# EAGLE design hoss-driver-circuit_25 (EAGLE 5.07)

## Sheet 1 of 4
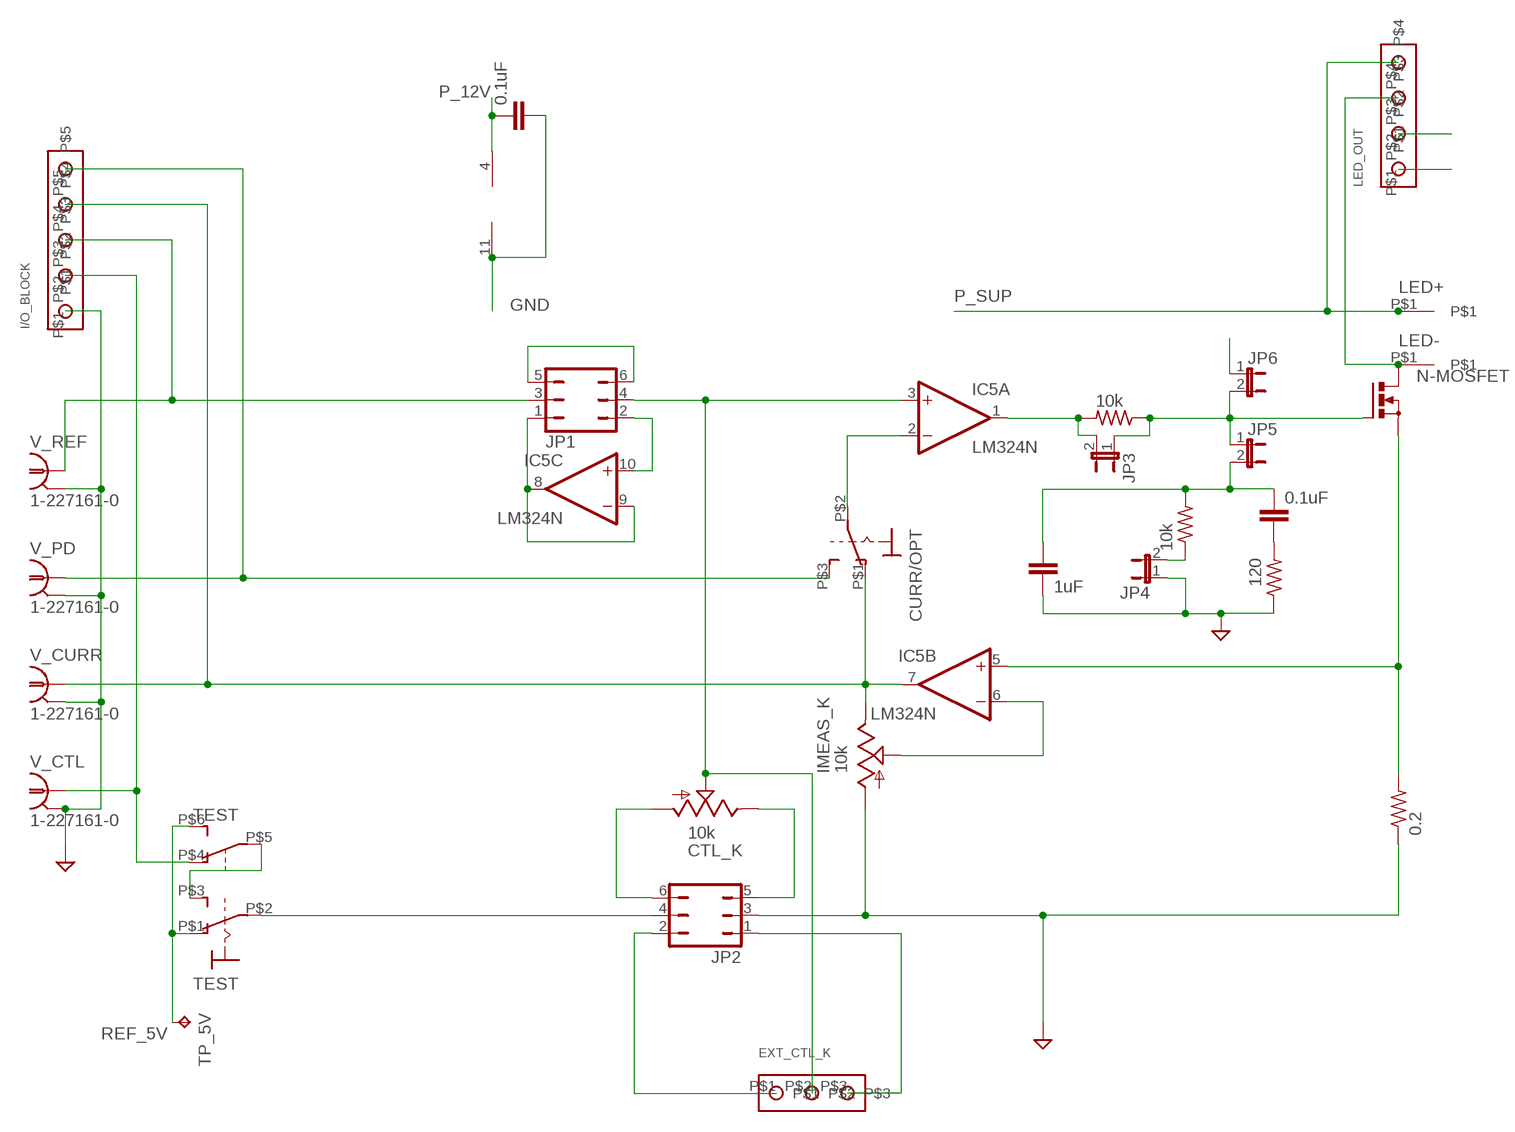
[diagram p0: schematic, sheet 1]

### Parts
C2  0.1uF  C-EU050-024X044  [C050-024X044]
C3  1uF  C-EU025-024X044  [C025-024X044]
C7  0.1uF  C-EU050-024X044  [C050-024X044]
CTL_K  10k  TRIM_US-RJ6S  [RJ6S]
CURR/OPT  SPST_SWITCH  [A_TOGGLE_SPST]
EXT_CTL_K  SCREW3  [SCREW3]
I/O_BLOCK  SCREW5  [SCREW5]
IC5  LM324N  [DIL14]
IMEAS_K  10k  TRIM_US-RJ6S  [RJ6S]
JP1  JP3Q  [JP3Q]
JP2  JP3Q  [JP3Q]
JP3  JP1E  [JP1]
JP4  JP1E  [JP1]
JP5  JP1E  [JP1]
JP6  JP1E  [JP1]
LED+  BANANA_TO_BOARD  [BANANA_TO_BOARD]
LED-  BANANA_TO_BOARD  [BANANA_TO_BOARD]
LED_OUT  SCREW4  [SCREW4]
N-MOSFET  PMOSFET_NTO220BH  [TO220BH]
R3  10k  R-US_0207/7  [0207/7]
R4  10k  R-US_0207/7  [0207/7]
R8  120  R-US_0207/7  [0207/7]
R_CURR  0.2  R-US_  [IMEAS_R]
TEST  SP3T_SWITCH  [320-938]
TP_5V  TPPAD1-13  [P1-13]
V_CTL  1-227161-0  [AMP_227161]
V_CURR  1-227161-0  [AMP_227161]
V_PD  1-227161-0  [AMP_227161]
V_REF  1-227161-0  [AMP_227161]

### Nets
GND: C3.2 C7.2 I/O_BLOCK.P$1 IC5.11(P:V-) IMEAS_K.A JP2.3 JP4.1 LED_OUT.P$1 R8.1 R_CURR.1 V_CTL.2(GND) V_CURR.2(GND) V_PD.2(GND) V_REF.2(GND) ; also sheet 2,3,4
N$1: CURR/OPT.P$2(P) IC5.2(A:-IN)
N$2: IC5.5(B:+IN) N-MOSFET.S R_CURR.2
N$3: IC5.1(A:OUT) JP3.2 R4.2
N$4: CURR/OPT.P$1(O) I/O_BLOCK.P$4 IC5.7(B:OUT) IMEAS_K.E V_CURR.1
N$5: CURR/OPT.P$3(S) I/O_BLOCK.P$5 V_PD.1
N$6: JP2.4 TEST.P$2(1:P)
N$7: CTL_K.E JP2.5
N$8: CTL_K.S EXT_CTL_K.P$2 IC5.3(A:+IN) JP1.4
N$9: IC5.8(C:OUT) IC5.9(C:-IN) JP1.1
N$10: I/O_BLOCK.P$2 TEST.P$4(B:O) V_CTL.1
N$11: C2.1 C3.1 JP5.2 R3.2
N$12: CTL_K.A JP2.6
N$13: C2.2 R8.2
N$14: IC5.10(C:+IN) JP1.2
N$15: IC5.6(B:-IN) IMEAS_K.S
N$17: JP1.5 JP1.6
N$18: I/O_BLOCK.P$3 JP1.3 V_REF.1
N$21: LED-.P$1 LED_OUT.P$3 N-MOSFET.D
N$23: TEST.P$3(1:S) TEST.P$5(B:P)
N$25: EXT_CTL_K.P$1 JP2.2
N$26: EXT_CTL_K.P$3 JP2.1
N$27: JP4.2 R3.1
N$29: JP3.1 JP5.1 JP6.2 N-MOSFET.G R4.1
N$69: JP6.1
P_12V: C7.1 IC5.4(P:V+) LED_OUT.P$2 ; also sheet 2
P_SUP: LED+.P$1 LED_OUT.P$4 ; also sheet 2,4
REF_5V: TEST.P$1(1:O) TEST.P$6(B:S) TP_5V.TP ; also sheet 2
Unconnected: IC5.12(D:+IN) IC5.13(D:-IN) IC5.14(D:OUT)

## Sheet 2 of 4
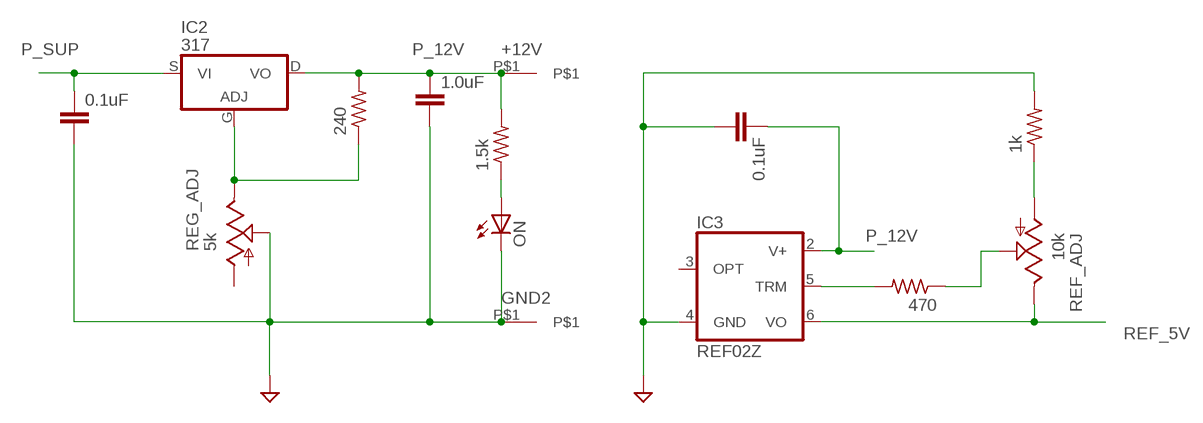
[diagram p1: schematic, sheet 2]

### Parts
+12V  BANANA_TO_BOARD  [BANANA_TO_BOARD]
C4  0.1uF  C-EU050-024X044  [C050-024X044]
C5  1.0uF  C-EU025-024X044  [C025-024X044]
C6  0.1uF  C-EU050-024X044  [C050-024X044]
GND2  BANANA_TO_BOARD  [BANANA_TO_BOARD]
IC2  317  [TO220BH]
IC3  REF02Z  [DIL08]
ON  LED3MM  [LED3MM]
R2  1.5k  R-US_0207/7  [0207/7]
R9  1k  R-US_0207/7  [0207/7]
R10  240  R-US_0207/7  [0207/7]
R12  470  R-US_0207/7  [0207/7]
REF_ADJ  10k  TRIM_US-RJ6S  [RJ6S]
REG_ADJ  5k  TRIM_US-RJ6S  [RJ6S]

### Nets
GND: C4.2 C5.2 C6.2 GND2.P$1 IC3.4(GND) ON.K(C) R9.2 REG_ADJ.S ; also sheet 1,3,4
N$19: IC2.G(ADJ) R10.1 REG_ADJ.E
N$20: IC3.5(TRM) R12.2
N$22: R12.1 REF_ADJ.S
N$24: R9.1 REF_ADJ.A
N$28: ON.A R2.1
P_12V: +12V.P$1 C5.1 C6.1 IC2.D(VO) IC3.2(V+) R2.2 R10.2 ; also sheet 1
P_SUP: C4.1 IC2.S(VI) ; also sheet 1,4
REF_5V: IC3.6(VO) REF_ADJ.E ; also sheet 1
Unconnected: IC3.3(OPT) REG_ADJ.A

## Sheet 3 of 4
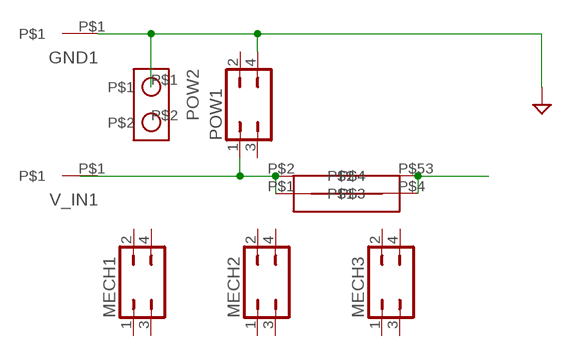
[diagram p2: schematic, sheet 3]

### Parts
GND1  BANANA_TO_BOARD  [BANANA_TO_BOARD]
MECH1  JP2Q  [JP2Q]
MECH2  JP2Q  [JP2Q]
MECH3  JP2Q  [JP2Q]
POW1  JP2Q  [JP2Q]
POW2  SCREW2  [SCREW2]
U$1  FUSE >2A  NXT-FUSE  [NXT-FUSE]
V_IN1  BANANA_TO_BOARD  [BANANA_TO_BOARD]

### Nets
GND: GND1.P$1 POW1.4 POW2.P$1 ; also sheet 1,2,4
N$61: POW1.1 U$1.P$1 U$1.P$2
P_SUP_BEFORE: U$1.P$4 U$1.P$53 ; also sheet 4
Unconnected: MECH1.1 MECH1.2 MECH1.3 MECH1.4 MECH2.1 MECH2.2 MECH2.3 MECH2.4 MECH3.1 MECH3.2 MECH3.3 MECH3.4 POW1.2 POW1.3 POW2.P$2 V_IN1.P$1

## Sheet 4 of 4
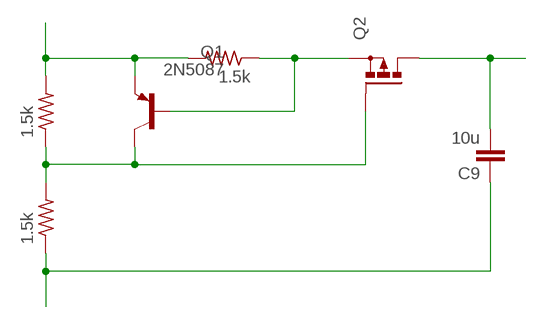
[diagram p3: schematic, sheet 4]

### Parts
C9  10u  C-EU025-024X044  [C025-024X044]
Q1  2N5087  [TO92]
Q2  PMOSFET_PTO220BH  [TO220BH]
R1  1.5k  R-US_0207/7  [0207/7]
R5  1.5k  R-US_0207/7  [0207/7]
R6  1.5k  R-US_0207/7  [0207/7]

### Nets
GND: C9.1 R5.1 ; also sheet 1,2,3
N$30: Q1.1(C) Q2.G R1.1 R5.2
N$31: Q1.2(B) Q2.S R6.1
P_SUP: C9.2 Q2.D ; also sheet 1,2
P_SUP_BEFORE: Q1.3(E) R1.2 R6.2 ; also sheet 3

## Library data of the parts
+12V GND1 GND2 LED+ LED- V_IN1 = HOSS:BANANA_TO_BOARD: Female banana socket to board, right angle. Digikey part: J111-ND (or similar).
C2-C7 C9 = rcl:C-EU: CAPACITOR, European symbol
CTL_K IMEAS_K REF_ADJ REG_ADJ = HOSS:TRIM_US-: POTENTIOMETER
CURR/OPT = HOSS:SPST_SWITCH: TOGGLE SWITCH distributor RS Components
EXT_CTL_K = HOSS:SCREW3
I/O_BLOCK = HOSS:SCREW5
IC2 = HOSS:*317: Positive VOLTAGE REGULATOR
IC3 = linear:REF02: VOLTAGE REFERENCE
IC5 = linear:LM324: OP AMP
JP1 JP2 = jumper:JP3Q: JUMPER
JP3-JP6 = jumper:JP1E: JUMPER
LED_OUT = HOSS:SCREW4
MECH1-MECH3 POW1 = jumper:JP2Q: JUMPER
N-MOSFET = transistor-power:PMOSFET_N: Power MOSFET N-Channel
ON = led:LED: LED OSRAM: - CHIPLED LG R971, LG N971, LY N971, LG Q971, LY Q971, LO R971, LY R971 LH N974, LH R974 LS Q976, LO Q976, LY Q976 LO Q996 - Hyper CHIPLED LW Q18S LB Q993, LB Q99A, LB R99A - SideLED LS A670, LO A670, LY A670, LG A670, LP A670 LB A673, LV A673, LT A673, LW A673 LH A674 LY A675 LS A676, LA A676, LO A676, LY A676, LW A676 LS A679, LY A679, LG A679 - Hyper Micro SIDELED® LS Y876, LA Y876, LO Y876, LY Y876 LT Y87S - SmartLED LW L88C, LW L88S LB L89C, LB L89S, LG L890 LS L89K, LO L89K, LY L89K LS L896, LA L896, LO L896, LY L896 - TOPLED LS T670, LO T670, LY T670, LG T670, LP T670 LSG T670, LSP T670, LSY T670, LOP T670, LYG T670 LG T671, LOG T671, LSG T671 LB T673, LV T673, LT T673, LW T673 LH T674 LS T676, LA T676, LO T676, LY T676, LB T676, LH T676, LSB T676, LW T676 LB T67C, LV T67C, LT T67C, LS T67K, LO T67K, LY T67K, LW E67C LS E67B, LA E67B, LO E67B, LY E67B, LB E67C, LV E67C, LT E67C LW T67C LS T679, LY T679, LG T679 LS T770, LO T770, LY T770, LG T770, LP T770 LB T773, LV T773, LT T773, LW T773 LH T774 LS E675, LA E675, LY E675, LS T675 LS T776, LA T776, LO T776, LY T776, LB T776 LHGB T686 LT T68C, LB T68C - Hyper Mini TOPLED® LB M676 - Mini TOPLED Santana® LG M470 LS M47K, LO M47K, LY M47K Source: http://www.osram.convergy.de LUXEON: - LUMILED® LXK2-PW12-R00, LXK2-PW12-S00, LXK2-PW14-U00, LXK2-PW14-V00 LXK2-PM12-R00, LXK2-PM12-S00, LXK2-PM14-U00 LXK2-PE12-Q00, LXK2-PE12-R00, LXK2-PE12-S00, LXK2-PE14-T00, LXK2-PE14-U00 LXK2-PB12-K00, LXK2-PB12-L00, LXK2-PB12-M00, LXK2-PB14-N00, LXK2-PB14-P00, LXK2-PB14-Q00 LXK2-PR12-L00, LXK2-PR12-M00, LXK2-PR14-Q00, LXK2-PR14-R00 LXK2-PD12-Q00, LXK2-PD12-R00, LXK2-PD12-S00 LXK2-PH12-R00, LXK2-PH12-S00 LXK2-PL12-P00, LXK2-PL12-Q00, LXK2-PL12-R00 Source: www.luxeon.com KINGBRIGHT: KA-3528ASYC Source: www.kingbright.com
POW2 = HOSS:SCREW2
Q1 = transistor-pnp:2N5087: PNP Transistor
Q2 = transistor-power:PMOSFET_P: Power MOSFET P-Channel
R1-R6 R8-R10 R12 R_CURR = HOSS:R-US_: RESISTOR, American symbol
TEST = HOSS:SP3T_SWITCH: TOGGLE SWITCH distributor RS Components
TP_5V = testpad:TP: Test pad
U$1 = HOSS:NXT-FUSE
V_CTL V_CURR V_PD V_REF = con-coax:?227161*: JACK, RIGHT ANGLE, 50 OHM, PCB, BNC Source: amp_227161.pdf

## Board
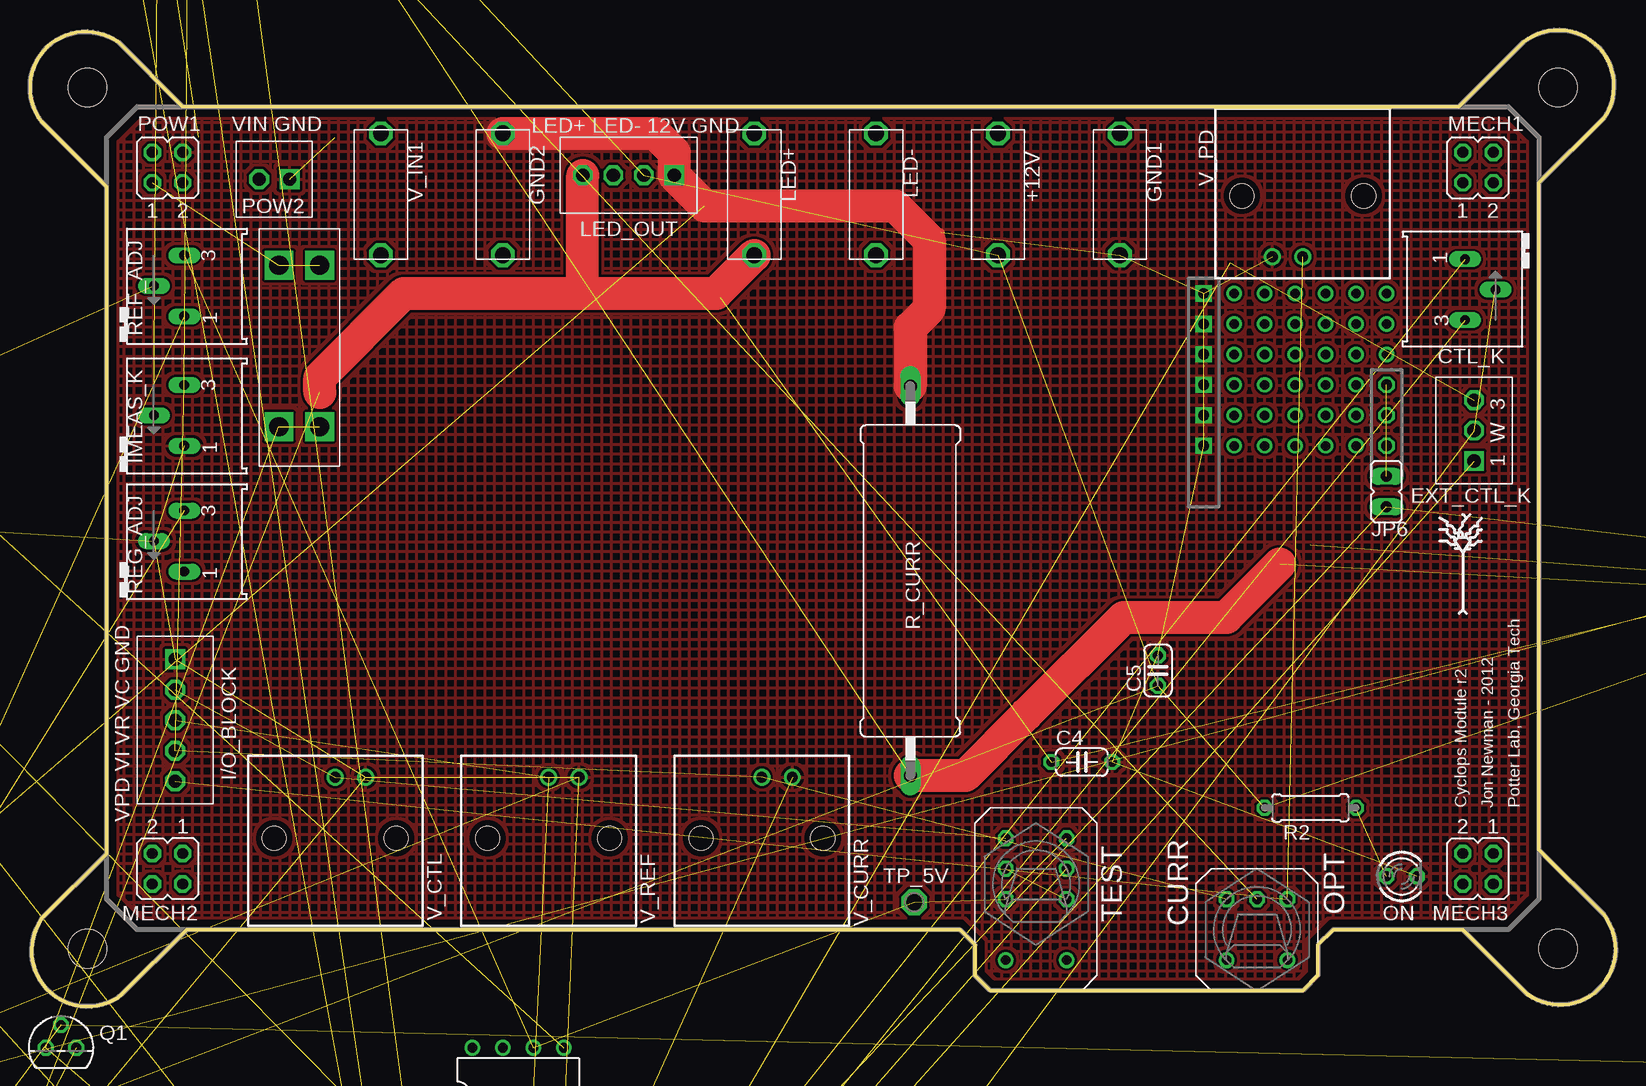
[diagram p4: board, top side]
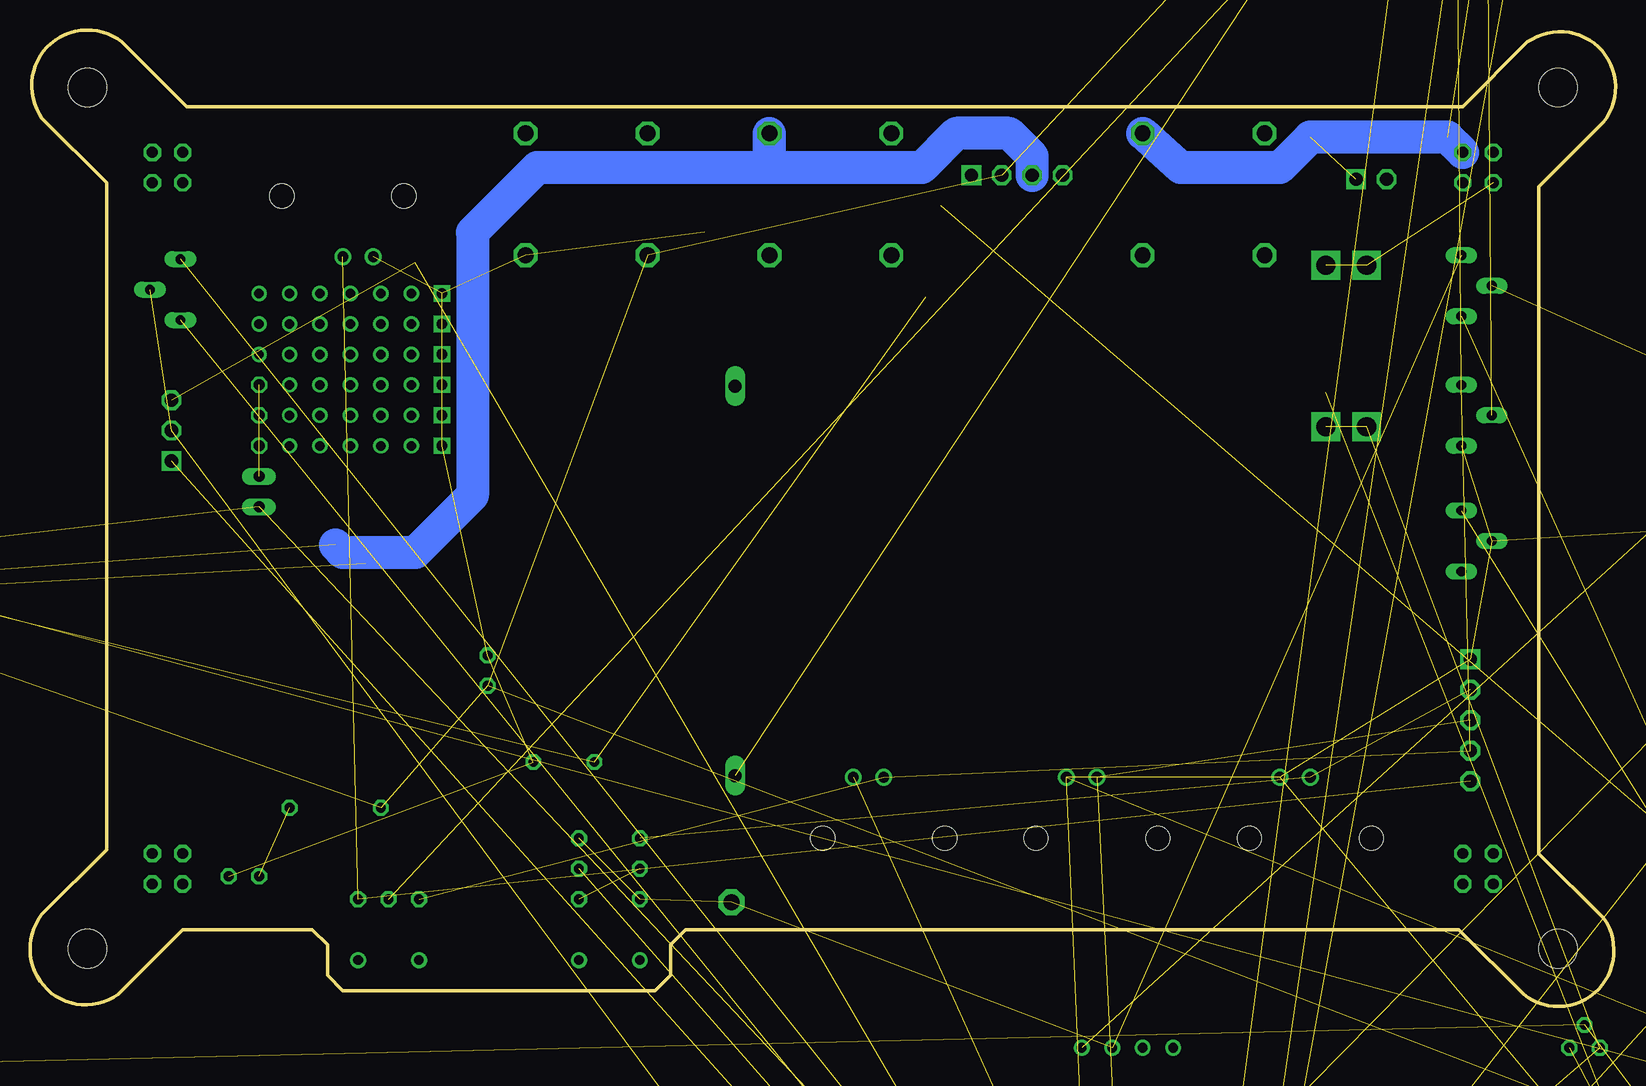
[diagram p5: board, bottom side, seen from below]

Size 132.17 x 81.37 mm. Coordinates in mm from the lower left corner, seen from the top.
Outline: 6.4,12.75 6.4,68.31 1,73.71 arc-164 7.35,80.37 12.75,74.98 119.11,74.98 124.51,80.37 arc-164 131.17,74.02 125.78,68.63 125.78,13.06 131.17,7.67 arc-164 124.82,1 119.43,6.4 108.63,6.4 107.36,5.13 107.36,2.59 106.09,1.32 80.06,1.32 78.79,2.59 78.79,5.13 77.52,6.4 13.06,6.4 7.67,1 arc-164 1,7.35 6.4,12.75
Copper layers (1*16): Top 0.035mm / dielectric 1.5mm / Bottom 0.035mm
Design rules "default *": minimum track width 24mil, minimum drill 15mil, track to track 8mil, track to pad 8mil, pad to pad 8mil, via to via 8mil, smd to smd 8mil, copper to edge 20mil, drill to drill 8mil, minimum pad ring 10mil, minimum via ring 8mil, stop-mask expansion 4mil, vias tented up to drill 0mil, thermal gap 10mil
Holes 3.2 mm at 127.36,76.56 4.81,4.81 127.36,4.81 4.81,76.56
tKeepout: area 112.8,-33 to 131.8,-15.2

### Footprints (pad centres in the part's own frame; a part is rotated, then mirrored left to right if it is on the bottom)
BANANA_TO_BOARD = drill 1.321 octagon: P$1 0,0; P$2 10.16,0
C050-024X044 = drill 0.813 octagon: 1 -2.54,0; 2 2.54,0
C025-024X044 = drill 0.813 octagon: 1 -1.27,0; 2 1.27,0
RJ6S = drill 0.813 long: A 2.54,-0.2; E -2.54,-0.2; S 0,-2.74
A_TOGGLE_SPST = drill 0.8 octagon: P$1 -2.54,6.35; P$2 0,6.35; P$3 2.54,6.35 | drill 0.8: P$14 2.54,1.27; P$15 -2.54,1.27
SCREW3 = drill 1.1 square: P$1 0,0 | drill 1.1 octagon: P$2 2.54,0; P$3 5.08,0
SCREW5 = drill 1.1 square: P$1 0,0 | drill 1.1 octagon: P$2 2.54,0; P$3 5.08,0; P$4 7.62,0; P$5 10.16,0
TO220BH = drill 1.118 long: D 0,-6.35; G -2.54,-6.35; S 2.54,-6.35 | hole 3.302: 0,11.176
DIL08 = drill 0.813 pad 1.27: 1 -3.81,-3.81; 2 -1.27,-3.81; 3 1.27,-3.81; 4 3.81,-3.81; 5 3.81,3.81; 6 1.27,3.81; 7 -1.27,3.81; 8 -3.81,3.81
DIL14 = drill 0.813 long: 1 -7.62,-3.81; 2 -5.08,-3.81; 3 -2.54,-3.81; 4 0,-3.81; 5 2.54,-3.81; 6 5.08,-3.81; 7 7.62,-3.81; 8 7.62,3.81; 9 5.08,3.81; 10 2.54,3.81; 11 0,3.81; 12 -2.54,3.81; 13 -5.08,3.81; 14 -7.62,3.81
JP3Q = drill 0.914 octagon: 1 -2.54,-1.27; 2 -2.54,1.27; 3 0,-1.27; 4 0,1.27; 5 2.54,-1.27; 6 2.54,1.27
JP1 = drill 0.914 long: 1 0,-1.27; 2 0,1.27
SCREW4 = drill 1.1 square: P$1 0,0 | drill 1.1 octagon: P$2 2.54,0; P$3 5.08,0; P$4 7.62,0
JP2Q = drill 0.914 octagon: 1 -1.27,-1.27; 2 -1.27,1.27; 3 1.27,-1.27; 4 1.27,1.27
LED3MM = drill 0.813 octagon: A -1.27,0; K 1.27,0
SCREW2 = drill 1.1 square: P$1 0,0 | drill 1.1 octagon: P$2 2.54,0
TO92 = drill 0.813 octagon: 1 1.27,0; 2 0,1.905; 3 -1.27,0
0207/7 = drill 0.813 octagon: 1 -3.81,0; 2 3.81,0
IMEAS_R = drill 1.1 long: 1 -3.23,0; 2 29.23,0
320-938 = drill 0.8 octagon: P$1 2.54,3.81; P$2 2.54,1.27; P$3 2.54,-1.27; P$4 -2.54,3.81; P$5 -2.54,1.27; P$6 -2.54,-1.27 | drill 0.8: P$14 2.54,-6.35; P$15 -2.54,-6.35
P1-13 = drill 1.321 pad 2.159 octagon: TP 0,0
NXT-FUSE = drill 1.6 square: P$1 3.048,1.651; P$2 3.048,5.055; P$4 16.51,5.055; P$53 16.51,1.651
AMP_227161 = drill 0.9 pad 1.27: 1 0,-5.08; 2 -2.54,-5.08 | hole 2: -5.08,0; 5.08,0

### Placement (x,y rotation side)
+12V  80.69,62.59 90 top
C2  -12.65,34.02 0 top  (outside the outline)
C3  -32.02,-7.89 180 top  (outside the outline)
C4  87.68,20.37 0 top
C5  94.03,27.99 90 top
C6  -25.35,-12.34 90 top  (outside the outline)
C7  -13.29,40.37 180 top  (outside the outline)
C9  -9.48,-31.07 0 top  (outside the outline)
CTL_K  119.43,59.74 90 top
CURR/OPT  102.28,2.59 0 top
EXT_CTL_K  120.38,45.45 90 top
GND1  90.85,62.59 90 top
GND2  39.42,72.75 270 top
I/O_BLOCK  12.11,28.94 270 top
IC2  184.83,51.8 0 top  (outside the outline)
IC3  40.69,-7.26 0 top  (outside the outline)
IC5  5.76,121.65 0 top  (outside the outline)
IMEAS_K  13.06,49.26 270 top
JP1  37.83,-64.72 90 top  (outside the outline)
JP2  28.3,-56.15 90 top  (outside the outline)
JP3  33.38,-32.34 270 top  (outside the outline)
JP4  32.43,-38.69 90 top  (outside the outline)
JP5  29.89,-45.36 90 top  (outside the outline)
JP6  113.08,42.91 180 top
LED+  60.37,62.59 90 top
LED-  70.53,72.75 270 top
LED_OUT  53.7,69.26 180 top
MECH1  120.7,69.9 0 top
MECH2  11.48,11.48 180 top
MECH3  120.7,11.48 180 top
N-MOSFET  192.77,25.76 180 top  (outside the outline)
ON  114.35,10.84 0 top
POW1  11.48,69.9 0 top
POW2  21.64,68.94 180 top
Q1  2.59,-3.45 0 top
Q2  217.53,-0.27 0 top  (outside the outline)
R1  4.49,-9.48 0 top  (outside the outline)
R2  106.73,16.56 180 top
R3  -17.1,18.14 90 top  (outside the outline)
R4  -11.38,27.03 90 top  (outside the outline)
R5  4.17,-13.92 0 top  (outside the outline)
R6  -6.94,-19.32 0 top  (outside the outline)
R8  -14.24,9.89 90 top  (outside the outline)
R9  -15.51,-1.54 90 top  (outside the outline)
R10  -18.37,-12.65 270 top  (outside the outline)
R12  -14.88,47.04 0 top  (outside the outline)
R_CURR  73.39,48.46 270 top
REF_ADJ  13.06,60.05 270 top
REG_ADJ  13.06,38.78 270 top
TEST  83.87,10.21 0 top
TP_5V  73.71,8.68 0 top
U$1  19.1,64.82 270 top
V_CTL  25.45,14.02 180 top
V_CURR  61.01,14.02 180 top
V_IN1  29.26,62.59 90 top
V_PD  106.09,67.55 0 top
V_REF  43.23,14.02 180 top

### Tracks (layer width: path | path; a pad name or v marks a point on that pad's centre or on a via)
GND  (via drill 0.9)  (29 unrouted)
  Top 0.61: 74.98,63.86 75.93,64.5
  Top 2.769: R_CURR.1 73.39,56.56 74.98,58.15 74.98,63.86 72.12,66.72 56.24,66.72 LED_OUT.P$1 53.7,71.17 52.12,72.75 GND2.P$1
  Bottom 2.769: GND2.P$1 36.24,69.9 27.99,69.9 25.45,72.44 14.02,72.44 POW1.4
  other vias: 97.84,46.72 97.84,49.26 97.84,51.8 97.84,54.34 97.84,56.88 97.84,59.42
  pour Top (hatched): 7.35,72.12 9.25,74.02 122.92,74.02 124.82,72.12 124.82,9.25 122.92,7.35 108.31,7.35 106.41,5.44 106.41,2.9 105.77,2.27 80.37,2.27 79.74,2.9 79.74,5.44 77.83,7.35 9.25,7.35 7.35,9.25
N$1  (1 unrouted)
N$2  (2 unrouted)
  Top 0.61: 82.28,25.13 83.07,24.33
  Top 2.769: 104.19,36.88 99.74,32.43 91.17,32.43 83.07,24.33 77.97,19.23 R_CURR.2
N$3  (4 unrouted)
N$4  (4 unrouted)
N$5  (2 unrouted)
N$6  (1 unrouted)
N$7  (1 unrouted)
N$8  (3 unrouted)
N$9  (2 unrouted)
N$10  (2 unrouted)
N$11  (3 unrouted)
N$12  (1 unrouted)
N$13  (1 unrouted)
N$14  (1 unrouted)
N$15  (1 unrouted)
N$17  (1 unrouted)
N$18  (2 unrouted)
N$19  (2 unrouted)
N$20  (1 unrouted)
N$21  (1 unrouted)
  Bottom 2.769: 106.73,38.46 106.09,37.83 100.06,37.83 95.3,42.59 95.3,64.5 89.9,69.9 70.53,69.9 | LED_OUT.P$3 48.62,70.85 50.53,72.75 54.97,72.75 57.83,69.9 70.53,69.9 | 70.53,69.9 LED-.P$1
N$22  (1 unrouted)
N$23  (1 unrouted)
N$24  (1 unrouted)
N$25  (1 unrouted)
N$26  (3 unrouted)
N$27  (1 unrouted)
N$28  (1 unrouted)
N$29  (4 unrouted)
N$30  (3 unrouted)
N$31  (2 unrouted)
N$32  (via drill 0.8 pad 1.27)
  other vias: 100.38,56.88
N$33  (via drill 0.8 pad 1.27)
  other vias: 113.08,54.34
N$34  (via drill 0.8 pad 1.27)
  other vias: 113.08,56.88
N$35  (via drill 0.8 pad 1.27)
  other vias: 110.54,56.88
N$36  (via drill 0.8 pad 1.27)
  other vias: 108,56.88
N$37  (via drill 0.8 pad 1.27)
  other vias: 105.46,56.88
N$38  (via drill 0.8 pad 1.27)
  other vias: 102.92,56.88
N$39  (via drill 0.8 pad 1.27)
  other vias: 105.46,46.72
N$40  (via drill 0.8 pad 1.27)
  other vias: 100.38,59.42
N$41  (via drill 0.8 pad 1.27)
  other vias: 102.92,59.42
N$42  (via drill 0.8 pad 1.27)
  other vias: 100.38,54.34
N$43  (via drill 0.8 pad 1.27)
  other vias: 102.92,54.34
N$44  (via drill 0.8 pad 1.27)
  other vias: 105.46,54.34
N$45  (via drill 0.8 pad 1.27)
  other vias: 108,54.34
N$46  (via drill 0.8 pad 1.27)
  other vias: 110.54,54.34
N$47  (via drill 0.8 pad 1.27)
  other vias: 110.54,51.8
N$48  (via drill 0.8 pad 1.27)
  other vias: 108,51.8
N$49  (via drill 0.8 pad 1.27)
  other vias: 105.46,51.8
N$50  (via drill 0.8 pad 1.27)
  other vias: 102.92,51.8
N$51  (via drill 0.8 pad 1.27)
  other vias: 100.38,51.8
N$52  (via drill 0.8 pad 1.27)
  other vias: 105.46,59.42
N$53  (via drill 0.8 pad 1.27)
  other vias: 108,59.42
N$54  (via drill 0.8 pad 1.27)
  other vias: 100.38,49.26
N$55  (via drill 0.8 pad 1.27)
  other vias: 102.92,49.26
N$56  (via drill 0.8 pad 1.27)
  other vias: 105.46,49.26
N$57  (via drill 0.8 pad 1.27)
  other vias: 108,49.26
N$58  (via drill 0.8 pad 1.27)
  other vias: 110.54,49.26
N$59  (via drill 0.8 pad 1.27)
  other vias: 110.54,46.72
N$60  (via drill 0.8 pad 1.27)
  other vias: 108,46.72
N$61  (2 unrouted)
N$62  (via drill 0.8 pad 1.27)
  other vias: 102.92,46.72
N$63  (via drill 0.8 pad 1.27)
  other vias: 100.38,46.72
N$64  (via drill 0.8 pad 1.27)
  other vias: 110.54,59.42
N$65  (via drill 0.8 pad 1.27)
  other vias: 113.08,59.42
N$69  (via drill 0.9)  (3 unrouted)
  other vias: 113.08,46.72 113.08,49.26 113.08,51.8
P_12V  (9 unrouted)
P_SUP  (4 unrouted)
  Top 0.61: 57.2,59.42 57.51,59.1 | 24.15,51.16 24.49,51.16 24.18,52.43
  Top 2.769: LED+.P$1 57.2,59.42 46.08,59.42 | 46.08,59.42 LED_OUT.P$4 | 46.08,59.42 31.16,59.42 24.18,52.43 | 24.15,51.16 24.15,52.41
P_SUP_BEFORE  (4 unrouted)
REF_5V  (4 unrouted)

### Text on the board
tPlace: VIN GND | LED+ LED- 12V GND | 1 W 3 | VPD VI VR VC GND | OPT | CURR
tNames: Cyclops Module r2 | Jon Newman - 2012 | Potter Lab, Georgia Tech
tDocu: V_GATE | GND | + | + | + | +